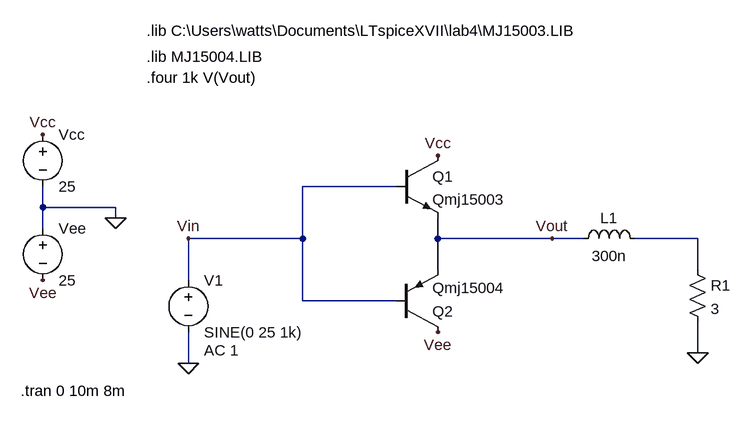
[diagram p0: schematic class_b_amplifier.asc]
class_b_amplifier.asc, the LTspice schematic file:
Version 4
SHEET 1 880 680
WIRE 208 48 64 48
WIRE -336 80 -336 48
WIRE -224 80 -336 80
WIRE -224 96 -224 80
WIRE -336 112 -336 80
WIRE 64 128 64 48
WIRE 64 128 -112 128
WIRE 272 128 272 96
WIRE 448 128 272 128
WIRE 496 128 448 128
WIRE 672 128 576 128
WIRE 272 176 272 128
WIRE 672 176 672 128
WIRE -112 192 -112 128
WIRE 64 224 64 128
WIRE 208 224 64 224
WIRE 672 304 672 256
WIRE -112 320 -112 272
FLAG 672 304 0
FLAG -112 320 0
FLAG 272 0 Vcc
FLAG 272 272 Vee
FLAG -336 -32 Vcc
FLAG -336 192 Vee
FLAG -224 96 0
FLAG 448 128 Vout
FLAG -112 128 Vin
SYMBOL npn 208 0 R0
SYMATTR InstName Q1
SYMATTR Value Qmj15003
SYMBOL pnp 208 272 M180
SYMATTR InstName Q2
SYMATTR Value Qmj15004
SYMBOL ind 480 144 R270
WINDOW 0 32 56 VTop 2
WINDOW 3 5 56 VBottom 2
SYMATTR InstName L1
SYMATTR Value 300n
SYMBOL res 656 160 R0
SYMATTR InstName R1
SYMATTR Value 3
SYMBOL voltage -112 176 R0
WINDOW 123 24 124 Left 2
WINDOW 39 0 0 Left 0
SYMATTR InstName V1
SYMATTR Value SINE(0 25 1k)
SYMATTR Value2 AC 1
SYMBOL voltage -336 -48 R0
WINDOW 123 0 0 Left 0
WINDOW 39 0 0 Left 0
SYMATTR InstName Vcc
SYMATTR Value 25
SYMBOL voltage -336 96 R0
WINDOW 123 0 0 Left 0
WINDOW 39 0 0 Left 0
SYMATTR InstName Vee
SYMATTR Value 25
TEXT -176 -192 Left 2 !.lib C:\\Users\\watts\\Documents\\LTspiceXVII\\lab4\\MJ15003.LIB
TEXT -176 -152 Left 2 !.lib MJ15004.LIB
TEXT -370 362 Left 2 !.tran 0 10m 8m
TEXT -176 -120 Left 2 !.four 1k V(Vout)

The netlist it stands for:
* class_b_amplifier.asc
Q1 Vcc Vin Vout 0 Qmj15003
Q2 Vee Vin Vout 0 Qmj15004
L1 Vout N001 300n
R1 N001 0 3
V1 Vin 0 SINE(0 25 1k) AC 1
Vcc Vcc 0 25
Vee 0 Vee 25
.model NPN NPN
.model PNP PNP
.lib standard.bjt
.lib C:\Users\watts\Documents\LTspiceXVII\lab4\MJ15003.LIB
.lib MJ15004.LIB
.tran 0 10m 8m
.four 1k V(Vout)
.backanno
.end